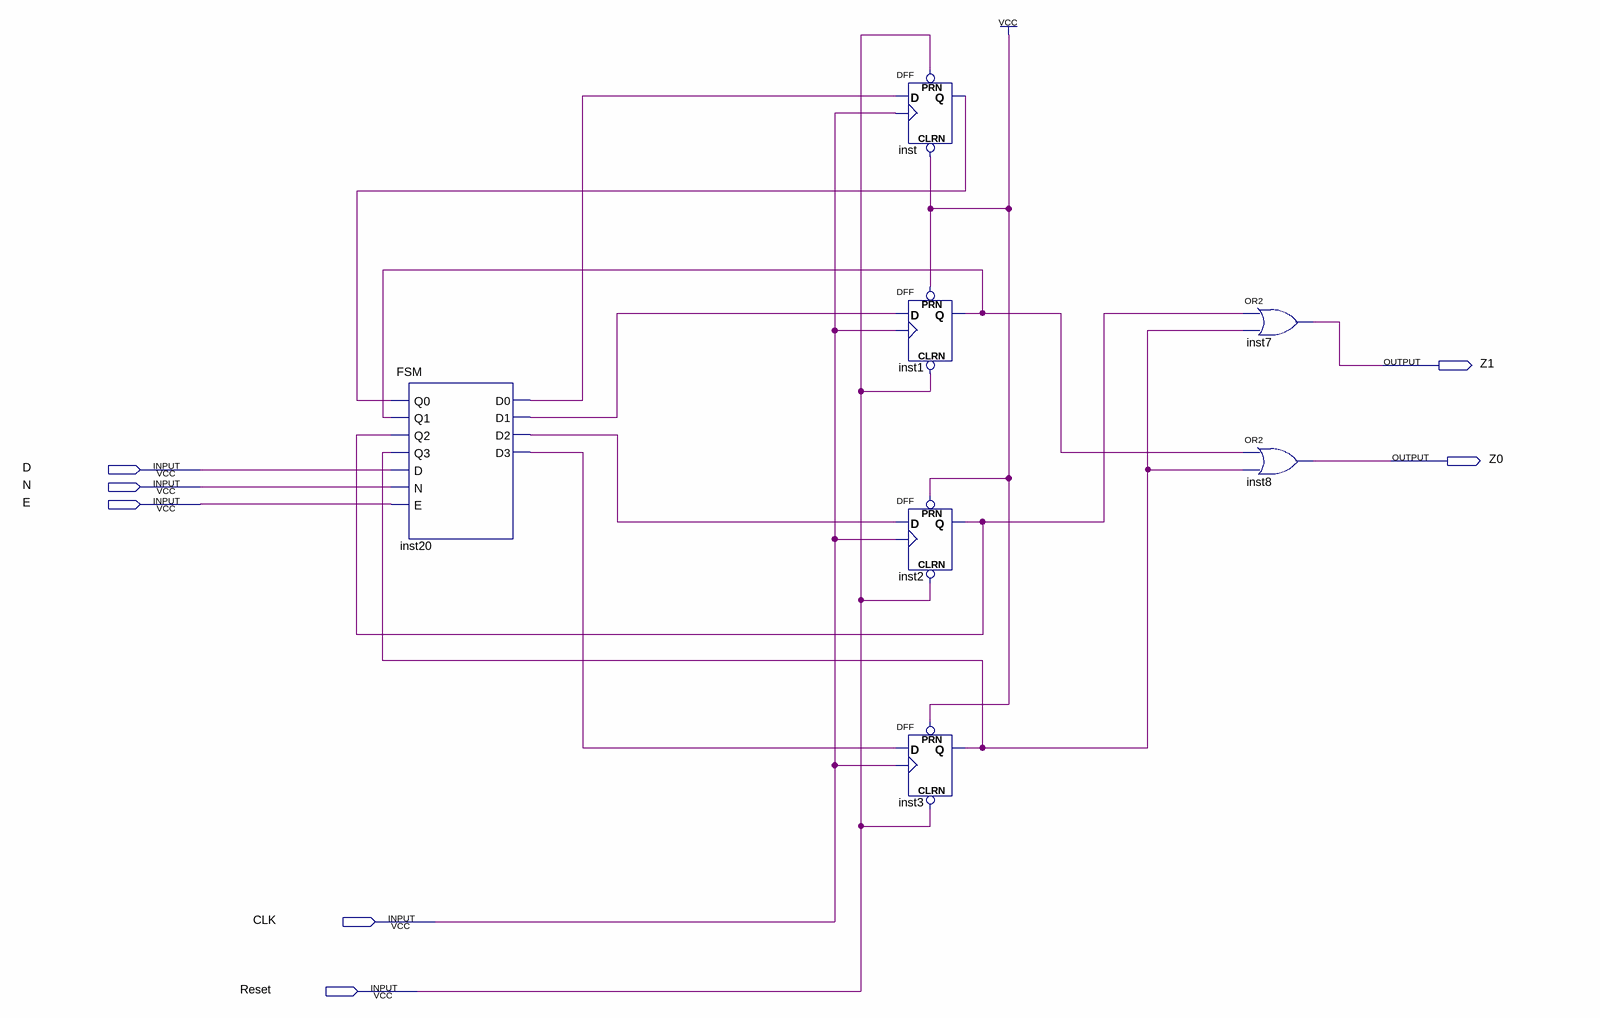
[diagram p0: schematic sheet]
// Quartus schematic new_state_machine.bdf as structural Verilog: 7 symbols, 7 pins
module new_state_machine (
  input  D,
  input  N,
  input  E,
  input  CLK,
  input  Reset,
  output Z1,
  output Z0
);

  wire inst1_q, inst2_q, inst3_q, inst20_d0, inst20_d1, inst20_d2, inst20_d3, inst_q;

  FSM inst20 (
    .Q0(inst_q), .Q1(inst1_q), .Q2(inst2_q), .Q3(inst3_q), .D(D), .N(N), .E(E), .D0(inst20_d0),
    .D1(inst20_d1), .D2(inst20_d2), .D3(inst20_d3));
  DFF inst (.CLRN(1'b1), .CLK(CLK), .D(inst20_d0), .PRN(Reset), .Q(inst_q));
  DFF inst1 (.CLRN(Reset), .CLK(CLK), .D(inst20_d1), .PRN(1'b1), .Q(inst1_q));
  DFF inst2 (.CLRN(Reset), .CLK(CLK), .D(inst20_d2), .PRN(1'b1), .Q(inst2_q));
  DFF inst3 (.CLRN(Reset), .CLK(CLK), .D(inst20_d3), .PRN(1'b1), .Q(inst3_q));
  or inst7 (Z1, inst2_q, inst3_q);
  or inst8 (Z0, inst1_q, inst3_q);
endmodule
